# EAGLE schematic DualMonoPSU3 (EAGLE 9.6.2)
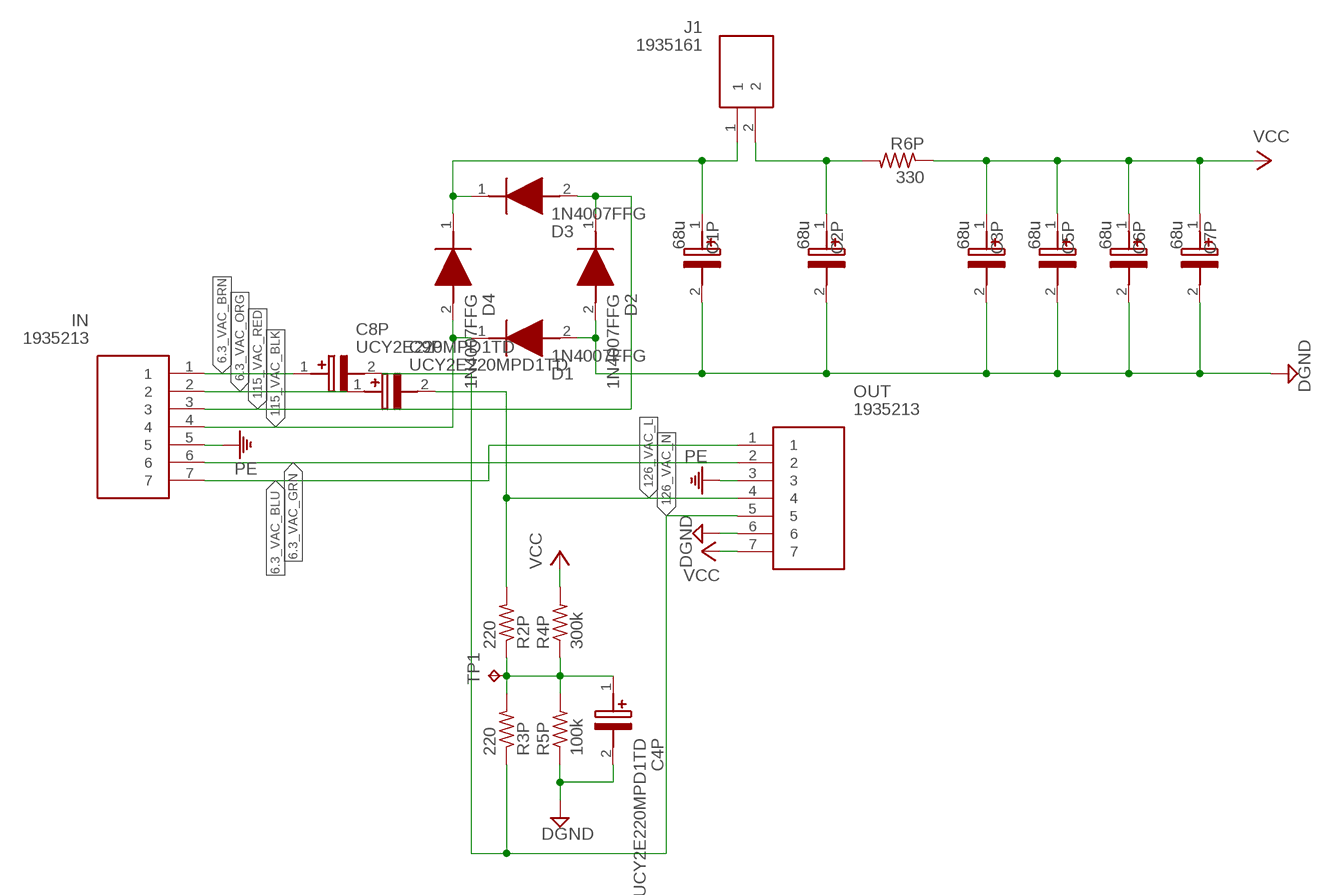
[diagram p0: schematic, sheet 1]

## Parts
C1P  68u  500HXW68MEFR14.5X45  [CAPPRD750W80D1475H4700]
C2P  68u  500HXW68MEFR14.5X45  [CAPPRD750W80D1475H4700]
C3P  68u  500HXW68MEFR14.5X45  [CAPPRD750W80D1475H4700]
C4P  UCY2E220MPD1TD  [CAPPRD500W60D1025H1750]
C5P  68u  500HXW68MEFR14.5X45  [CAPPRD750W80D1475H4700]
C6P  68u  500HXW68MEFR14.5X45  [CAPPRD750W80D1475H4700]
C7P  68u  500HXW68MEFR14.5X45  [CAPPRD750W80D1475H4700]
C8P  UCY2E220MPD1TD  [CAPPRD500W60D1025H1750]
C9P  UCY2E220MPD1TD  [CAPPRD500W60D1025H1750]
D1  1N4007FFG  [DIOAD1405W86L465D235]
D2  1N4007FFG  [DIOAD1405W86L465D235]
D3  1N4007FFG  [DIOAD1405W86L465D235]
D4  1N4007FFG  [DIOAD1405W86L465D235]
IN  1935213  [1935213]
J1  1935161  [1935161]
OUT  1935213  [1935213]
R2P  220  R-US_0411/15  [0411/15]
R3P  220  R-US_0411/15  [0411/15]
R4P  300k  R-US_0411/15  [0411/15]
R5P  100k  R-US_0411/15  [0411/15]
R6P  330  R-US_0411/15  [0411/15]
TP1  TPB2,54  [B2,54]

## Nets
6.3_VAC_BLU: IN.7 OUT.1
6.3_VAC_BRN: C8P.1(+) IN.1
6.3_VAC_GRN: IN.6 OUT.2
6.3_VAC_ORG: C9P.1(+) IN.2
115_VAC_BLK: D1.1(K) D4.2(A) IN.4
115_VAC_RED: D2.1(K) D3.2(A) IN.3
126_VAC_L: C9P.2(-) OUT.4 R2P.2
126_VAC_N: C8P.2(-) OUT.5 R3P.1
DGND: C1P.2(-) C2P.2(-) C3P.2(-) C4P.2(-) C5P.2(-) C6P.2(-) C7P.2(-) D1.2(A) D2.2(A) OUT.6 R5P.1
N$3: C1P.1(+) D3.1(K) D4.1(K) J1.1
N$5: C2P.1(+) J1.2 R6P.2
N$6: C4P.1(+) R2P.1 R3P.2 R4P.1 R5P.2 TP1.TP
PE: IN.5 OUT.3
VCC: C3P.1(+) C5P.1(+) C6P.1(+) C7P.1(+) OUT.7 R4P.2 R6P.1

## Library data of the parts
C1P C2P C3P C5P C6P C7P = 500HXW68MEFR14.5X45:500HXW68MEFR14.5X45: Aluminum Electrolytic Capacitors - Radial Leaded GENERAL PURPOSE ELECTROLYTIC CAPACITORS Source: Datasheet <https://www.mouser.com/datasheet/2/977/e_HXW-1600623.pdf>; DESCRIPTION: Aluminum Electrolytic Capacitors - Radial Leaded GENERAL PURPOSE ELECTROLYTIC CAPACITORS; HEIGHT: 47mm; MANUFACTURER_NAME: Rubycon; MANUFACTURER_PART_NUMBER: 500HXW68MEFR14.5X45
C4P C8P C9P = UCY2E220MPD1TD:UCY2E220MPD1TD: Aluminum Electrolytic Capacitors - Radial Leaded 22uF 250V 20% AEC-Q200 Source: Datasheet <https://www.mouser.in/datasheet/2/293/e_ucy-3082387.pdf>; DESCRIPTION: Aluminum Electrolytic Capacitors - Radial Leaded 22uF 250V 20% AEC-Q200; HEIGHT: 17.5mm; MANUFACTURER_NAME: Nichicon; MANUFACTURER_PART_NUMBER: UCY2E220MPD1TD; MOUSER_PART_NUMBER: 647-UCY2E220MPD1TD; MOUSER_PRICE-STOCK: https://www.mouser.co.uk/ProductDetail/Nichicon/UCY2E220MPD1TD?qs=JgOBn5pVFooNXIGMeLbPFg%3D%3D
D1-D4 = 1N4007FFG:1N4007FFG: Rectifiers 1000V 1A Standard Source: Datasheet <http://www.onsemi.com/pub_link/Collateral/1N4001-D.PDF>; DESCRIPTION: Rectifiers 1000V 1A Standard; HEIGHT: mm; MANUFACTURER_NAME: onsemi; MANUFACTURER_PART_NUMBER: 1N4007FFG; MOUSER_PART_NUMBER: 863-1N4007FFG; MOUSER_PRICE-STOCK: https://www.mouser.co.uk/ProductDetail/onsemi/1N4007FFG?qs=y2kkmE52mdPFE87Rxbyfgw%3D%3D
IN OUT = 1935213:1935213: Fixed Terminal Blocks PT 1.5/7-5.0-H Source: Datasheet <https://datasheet.datasheetarchive.com/originals/distributors/SFDatasheet-2/sf-00057464.pdf>; DESCRIPTION: Fixed Terminal Blocks PT 1.5/7-5.0-H; HEIGHT: 11.55mm; MANUFACTURER_NAME: Phoenix Contact; MANUFACTURER_PART_NUMBER: 1935213; MOUSER_PART_NUMBER: 651-1935213; MOUSER_PRICE-STOCK: https://www.mouser.co.uk/ProductDetail/Phoenix-Contact/1935213?qs=wd%252Bw3mUqFrnK4kINj%2Fk1Qg%3D%3D
J1 = 1935161:1935161: Phoenix Contact COMBICON PT PCB Terminal Block, 2 Way/Pole, Screw Terminals, 26 14 AWG Through Hole, Nylon Source: Datasheet <https://datasheet.datasheetarchive.com/originals/distributors/SFDatasheet-2/sf-00057459.pdf>; DESCRIPTION: Phoenix Contact COMBICON PT PCB Terminal Block, 2 Way/Pole, Screw Terminals, 26 14 AWG Through Hole, Nylon; HEIGHT: 11.55mm; MANUFACTURER_NAME: Phoenix Contact; MANUFACTURER_PART_NUMBER: 1935161; MOUSER_PART_NUMBER: 651-1935161; MOUSER_PRICE-STOCK: https://www.mouser.co.uk/ProductDetail/Phoenix-Contact/1935161?qs=W3wJikR1%252BS6eKzfFl8Rbew%3D%3D
R2P R3P R4P R5P R6P = rcl:R-US_: RESISTOR, American symbol; SPICEPREFIX: R
TP1 = testpad:TP: Test pad

## Net classes
3 Power: width 1.27 mm, drill 1.27 mm, clearance 0.254 mm